# Altium schematic sheet 09 High Speed-Connector.SchDoc: CM4 IO
size 420 x 297 mm; Page Create Date: March  8, 1995; Page Number: 9; Page Size: A3; Comment: radxa_1010; Page Count: 19; RevCode: V1.10; Doc: 09 High Speed-Connector; DsnPath: D:\WMS\黄工\[RC126]CM4_IO_V1.10\[RC126]_V1.10\CM4 IO_V1.10.DSN; SchematicName: CM4 IO V1.10; PageName: 09 High Speed-Connector; PageSize: A3; TopSchematic: True
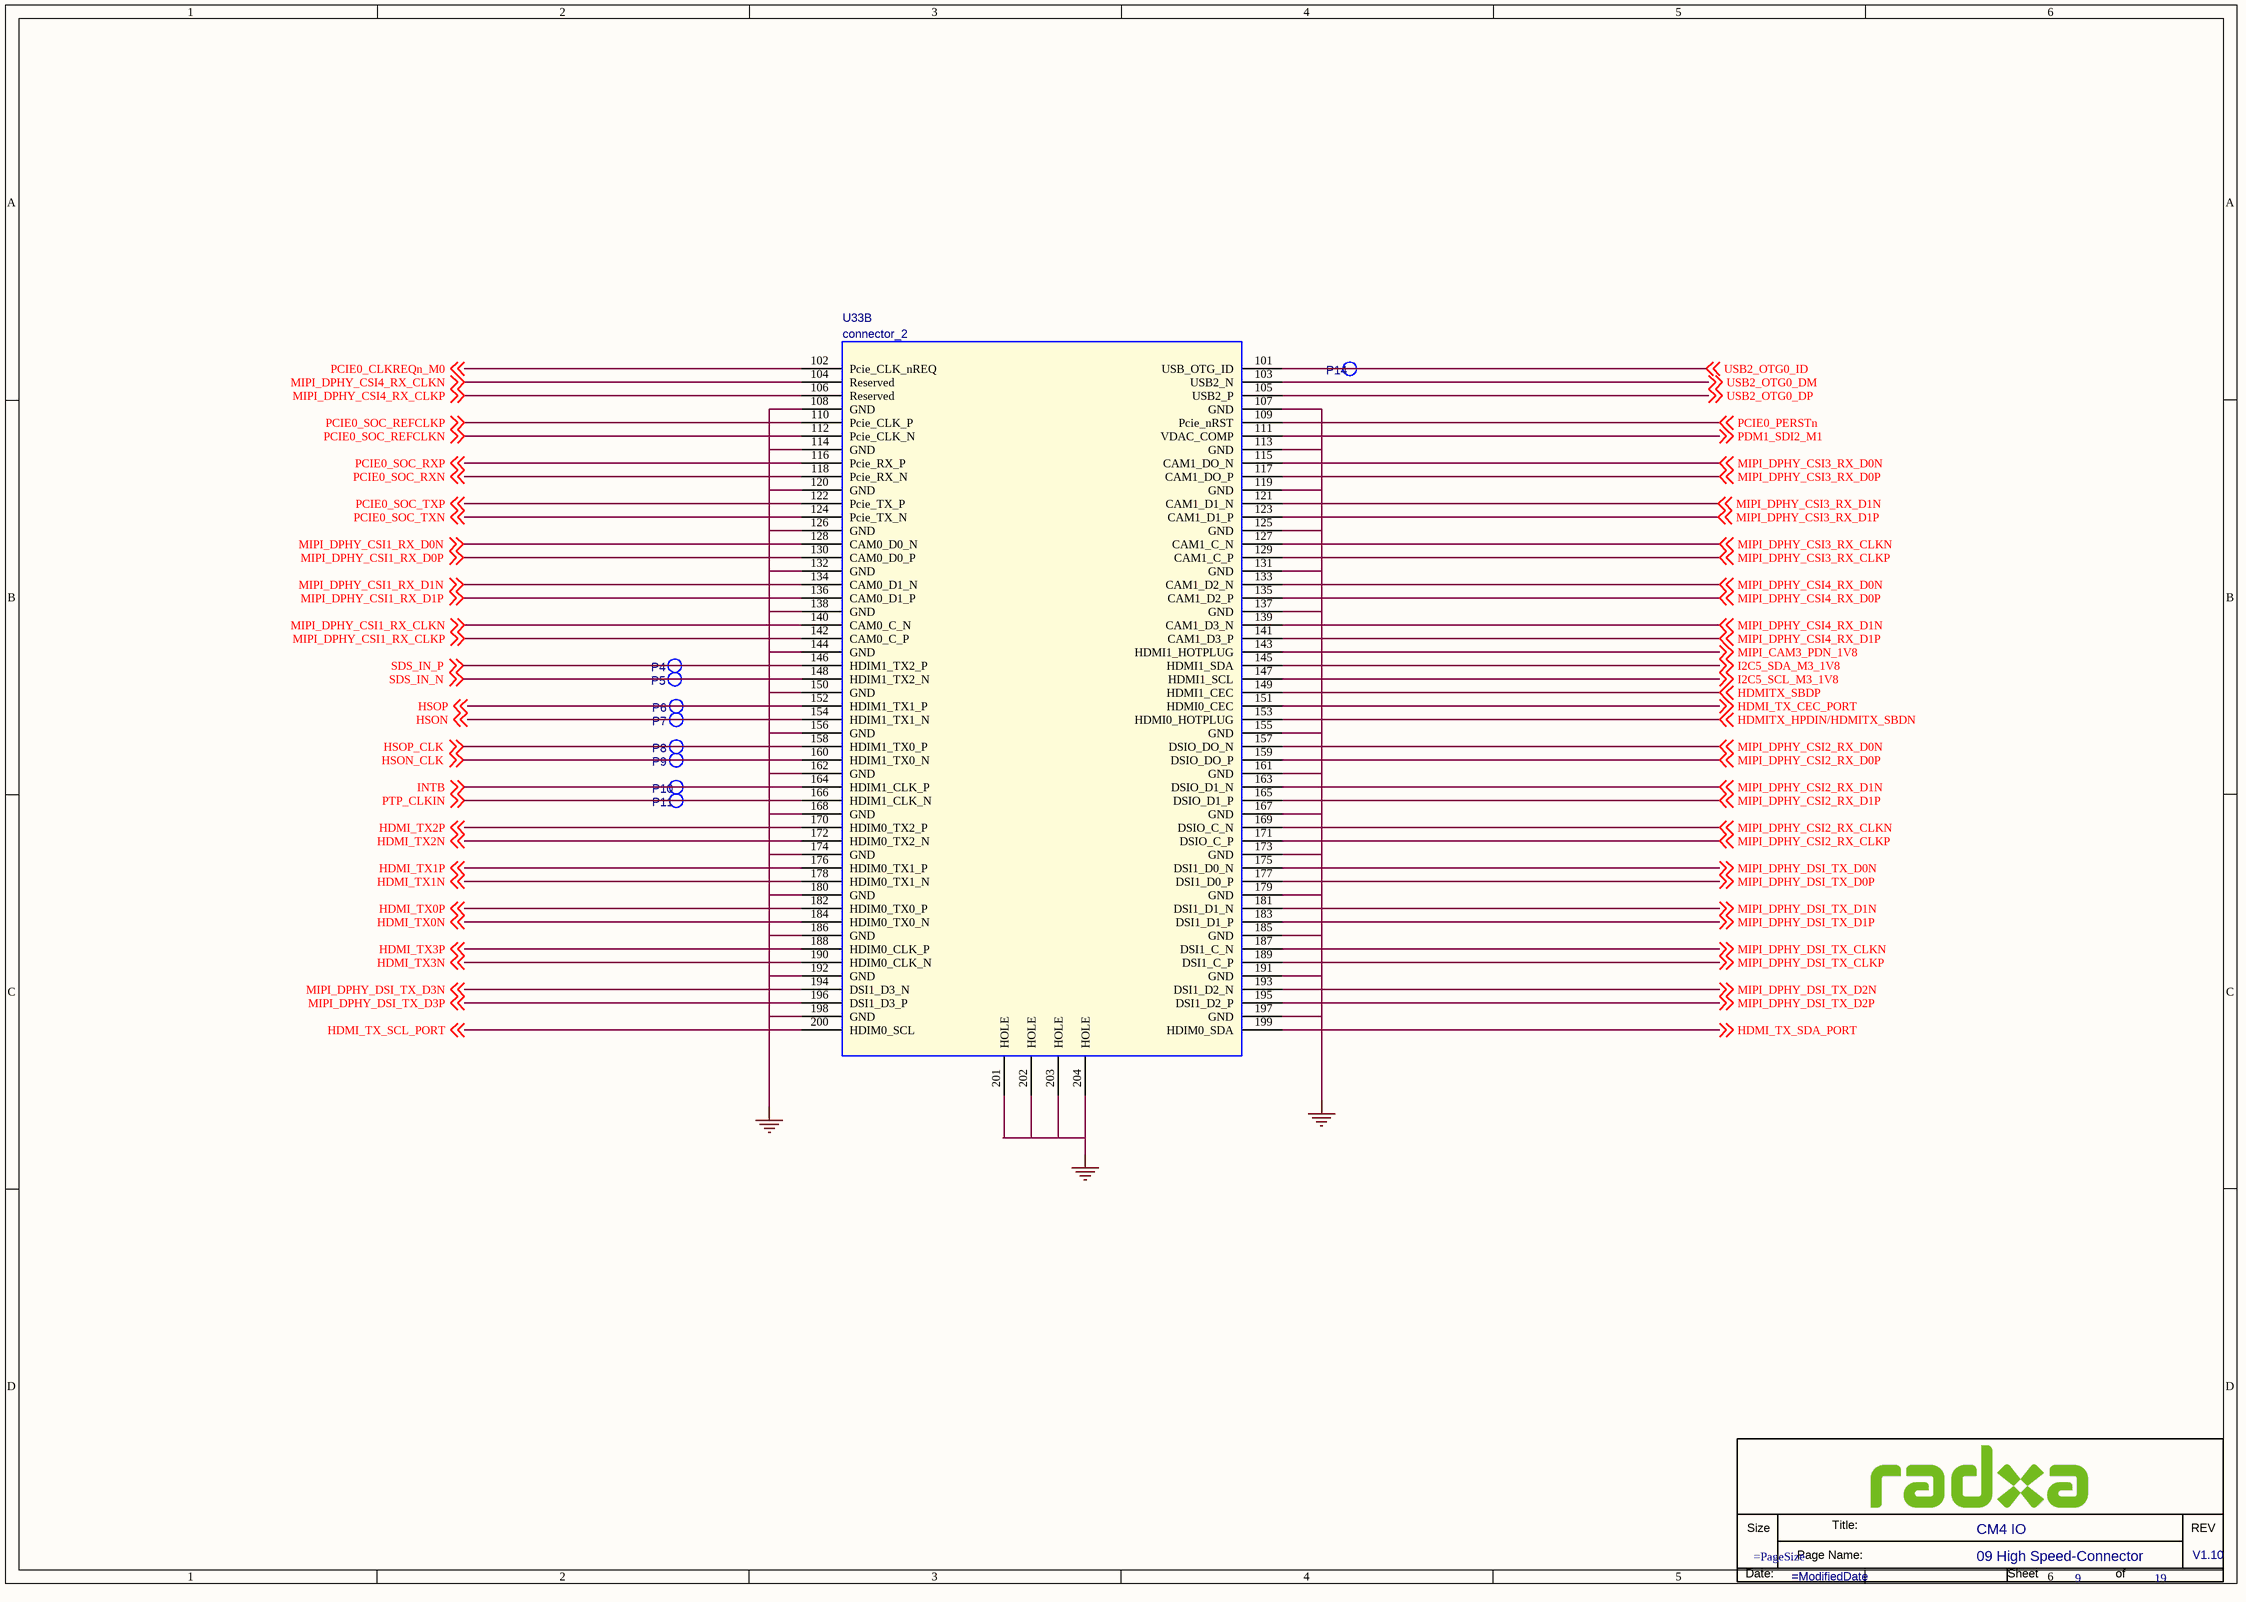
[diagram p0: 09 High Speed-Connector.SchDoc]

## Parts
*  Doc: 09 High Speed-Connector  RevCode: V1.10  Title: CM4 IO  Page Number: 9  Page Count: 19  (hidden comment: radxa_1010)  (graphical)
P4  TEST  [TEST]  (value not drawn)
P5  TEST  [TEST]  (value not drawn)
P6  TEST  [TEST]  (value not drawn)
P7  TEST  [TEST]  (value not drawn)
P8  TEST  [TEST]  (value not drawn)
P9  TEST  [TEST]  (value not drawn)
P10  TEST  [TEST]  (value not drawn)
P11  TEST  [TEST]  (value not drawn)
P14  TEST  [TEST]  (value not drawn)
U33  connector_2  [BTB_SMD100X2_0D4_STA]  (part B of 2)

## Nets
GND: U33.107(GND) U33.108(GND) U33.113(GND) U33.114(GND) U33.119(GND) U33.120(GND) U33.125(GND) U33.126(GND) U33.131(GND) U33.132(GND) U33.137(GND) U33.138(GND) U33.144(GND) U33.150(GND) U33.155(GND) U33.156(GND) U33.161(GND) U33.162(GND) U33.167(GND) U33.168(GND) U33.173(GND) U33.174(GND) U33.179(GND) U33.180(GND) U33.185(GND) U33.186(GND) U33.191(GND) U33.192(GND) U33.197(GND) U33.198(GND) U33.201(HOLE) U33.202(HOLE) U33.203(HOLE) U33.204(HOLE)
HDMI_TX0N: U33.184(HDIM0_TX0_N) ; off-sheet HDMI_TX0N
HDMI_TX0P: U33.182(HDIM0_TX0_P) ; off-sheet HDMI_TX0P
HDMI_TX1N: U33.178(HDIM0_TX1_N) ; off-sheet HDMI_TX1N
HDMI_TX1P: U33.176(HDIM0_TX1_P) ; off-sheet HDMI_TX1P
HDMI_TX2N: U33.172(HDIM0_TX2_N) ; off-sheet HDMI_TX2N
HDMI_TX2P: U33.170(HDIM0_TX2_P) ; off-sheet HDMI_TX2P
HDMI_TX3N: U33.190(HDIM0_CLK_N) ; off-sheet HDMI_TX3N
HDMI_TX3P: U33.188(HDIM0_CLK_P) ; off-sheet HDMI_TX3P
HDMI_TX_CEC_PORT: U33.151(HDMI0_CEC) ; off-sheet HDMI_TX_CEC_PORT
HDMI_TX_SCL_PORT: U33.200(HDIM0_SCL) ; off-sheet HDMI_TX_SCL_PORT
HDMI_TX_SDA_PORT: U33.199(HDIM0_SDA) ; off-sheet HDMI_TX_SDA_PORT
HDMITX_HPDIN/HDMITX_SBDN: U33.153(HDMI0_HOTPLUG) ; off-sheet HDMITX_HPDIN/HDMITX_SBDN
HDMITX_SBDP: U33.149(HDMI1_CEC) ; off-sheet HDMITX_SBDP
HSON: P7.1 U33.154(HDIM1_TX1_N) ; off-sheet HSON
HSON_CLK: P9.1 U33.160(HDIM1_TX0_N) ; off-sheet HSON_CLK
HSOP: P6.1 U33.152(HDIM1_TX1_P) ; off-sheet HSOP
HSOP_CLK: P8.1 U33.158(HDIM1_TX0_P) ; off-sheet HSOP_CLK
I2C5_SCL_M3_1V8: U33.147(HDMI1_SCL) ; off-sheet I2C5_SCL_M3_1V8
I2C5_SDA_M3_1V8: U33.145(HDMI1_SDA) ; off-sheet I2C5_SDA_M3_1V8
INTB: P10.1 U33.164(HDIM1_CLK_P) ; off-sheet INTB
MIPI_CAM3_PDN_1V8: U33.143(HDMI1_HOTPLUG) ; off-sheet MIPI_CAM3_PDN_1V8
MIPI_DPHY_CSI1_RX_CLKN: U33.140(CAM0_C_N) ; off-sheet MIPI_DPHY_CSI1_RX_CLKN
MIPI_DPHY_CSI1_RX_CLKP: U33.142(CAM0_C_P) ; off-sheet MIPI_DPHY_CSI1_RX_CLKP
MIPI_DPHY_CSI1_RX_D0N: U33.128(CAM0_D0_N) ; off-sheet MIPI_DPHY_CSI1_RX_D0N
MIPI_DPHY_CSI1_RX_D0P: U33.130(CAM0_D0_P) ; off-sheet MIPI_DPHY_CSI1_RX_D0P
MIPI_DPHY_CSI1_RX_D1N: U33.134(CAM0_D1_N) ; off-sheet MIPI_DPHY_CSI1_RX_D1N
MIPI_DPHY_CSI1_RX_D1P: U33.136(CAM0_D1_P) ; off-sheet MIPI_DPHY_CSI1_RX_D1P
MIPI_DPHY_CSI2_RX_CLKN: U33.169(DSIO_C_N) ; off-sheet MIPI_DPHY_CSI2_RX_CLKN
MIPI_DPHY_CSI2_RX_CLKP: U33.171(DSIO_C_P) ; off-sheet MIPI_DPHY_CSI2_RX_CLKP
MIPI_DPHY_CSI2_RX_D0N: U33.157(DSIO_DO_N) ; off-sheet MIPI_DPHY_CSI2_RX_D0N
MIPI_DPHY_CSI2_RX_D0P: U33.159(DSIO_DO_P) ; off-sheet MIPI_DPHY_CSI2_RX_D0P
MIPI_DPHY_CSI2_RX_D1N: U33.163(DSIO_D1_N) ; off-sheet MIPI_DPHY_CSI2_RX_D1N
MIPI_DPHY_CSI2_RX_D1P: U33.165(DSIO_D1_P) ; off-sheet MIPI_DPHY_CSI2_RX_D1P
MIPI_DPHY_CSI3_RX_CLKN: U33.127(CAM1_C_N) ; off-sheet MIPI_DPHY_CSI3_RX_CLKN
MIPI_DPHY_CSI3_RX_CLKP: U33.129(CAM1_C_P) ; off-sheet MIPI_DPHY_CSI3_RX_CLKP
MIPI_DPHY_CSI3_RX_D0N: U33.115(CAM1_DO_N) ; off-sheet MIPI_DPHY_CSI3_RX_D0N
MIPI_DPHY_CSI3_RX_D0P: U33.117(CAM1_DO_P) ; off-sheet MIPI_DPHY_CSI3_RX_D0P
MIPI_DPHY_CSI3_RX_D1N: U33.121(CAM1_D1_N) ; off-sheet MIPI_DPHY_CSI3_RX_D1N
MIPI_DPHY_CSI3_RX_D1P: U33.123(CAM1_D1_P) ; off-sheet MIPI_DPHY_CSI3_RX_D1P
MIPI_DPHY_CSI4_RX_CLKN: U33.104(Reserved) ; off-sheet MIPI_DPHY_CSI4_RX_CLKN
MIPI_DPHY_CSI4_RX_CLKP: U33.106(Reserved) ; off-sheet MIPI_DPHY_CSI4_RX_CLKP
MIPI_DPHY_CSI4_RX_D0N: U33.133(CAM1_D2_N) ; off-sheet MIPI_DPHY_CSI4_RX_D0N
MIPI_DPHY_CSI4_RX_D0P: U33.135(CAM1_D2_P) ; off-sheet MIPI_DPHY_CSI4_RX_D0P
MIPI_DPHY_CSI4_RX_D1N: U33.139(CAM1_D3_N) ; off-sheet MIPI_DPHY_CSI4_RX_D1N
MIPI_DPHY_CSI4_RX_D1P: U33.141(CAM1_D3_P) ; off-sheet MIPI_DPHY_CSI4_RX_D1P
MIPI_DPHY_DSI_TX_CLKN: U33.187(DSI1_C_N) ; off-sheet MIPI_DPHY_DSI_TX_CLKN
MIPI_DPHY_DSI_TX_CLKP: U33.189(DSI1_C_P) ; off-sheet MIPI_DPHY_DSI_TX_CLKP
MIPI_DPHY_DSI_TX_D0N: U33.175(DSI1_D0_N) ; off-sheet MIPI_DPHY_DSI_TX_D0N
MIPI_DPHY_DSI_TX_D0P: U33.177(DSI1_D0_P) ; off-sheet MIPI_DPHY_DSI_TX_D0P
MIPI_DPHY_DSI_TX_D1N: U33.181(DSI1_D1_N) ; off-sheet MIPI_DPHY_DSI_TX_D1N
MIPI_DPHY_DSI_TX_D1P: U33.183(DSI1_D1_P) ; off-sheet MIPI_DPHY_DSI_TX_D1P
MIPI_DPHY_DSI_TX_D2N: U33.193(DSI1_D2_N) ; off-sheet MIPI_DPHY_DSI_TX_D2N
MIPI_DPHY_DSI_TX_D2P: U33.195(DSI1_D2_P) ; off-sheet MIPI_DPHY_DSI_TX_D2P
MIPI_DPHY_DSI_TX_D3N: U33.194(DSI1_D3_N) ; off-sheet MIPI_DPHY_DSI_TX_D3N
MIPI_DPHY_DSI_TX_D3P: U33.196(DSI1_D3_P) ; off-sheet MIPI_DPHY_DSI_TX_D3P
PCIE0_CLKREQn_M0: U33.102(Pcie_CLK_nREQ) ; off-sheet PCIE0_CLKREQn_M0
PCIE0_PERSTn: U33.109(Pcie_nRST) ; off-sheet PCIE0_PERSTn
PCIE0_SOC_REFCLKN: U33.112(Pcie_CLK_N) ; off-sheet PCIE0_SOC_REFCLKN
PCIE0_SOC_REFCLKP: U33.110(Pcie_CLK_P) ; off-sheet PCIE0_SOC_REFCLKP
PCIE0_SOC_RXN: U33.118(Pcie_RX_N) ; off-sheet PCIE0_SOC_RXN
PCIE0_SOC_RXP: U33.116(Pcie_RX_P) ; off-sheet PCIE0_SOC_RXP
PCIE0_SOC_TXN: U33.124(Pcie_TX_N) ; off-sheet PCIE0_SOC_TXN
PCIE0_SOC_TXP: U33.122(Pcie_TX_P) ; off-sheet PCIE0_SOC_TXP
PDM1_SDI2_M1: U33.111(VDAC_COMP) ; off-sheet PDM1_SDI2_M1
PTP_CLKIN: P11.1 U33.166(HDIM1_CLK_N) ; off-sheet PTP_CLKIN
SDS_IN_N: P5.1 U33.148(HDIM1_TX2_N) ; off-sheet SDS_IN_N
SDS_IN_P: P4.1 U33.146(HDIM1_TX2_P) ; off-sheet SDS_IN_P
USB2_OTG0_DM: U33.103(USB2_N) ; off-sheet USB2_OTG0_DM
USB2_OTG0_DP: U33.105(USB2_P) ; off-sheet USB2_OTG0_DP
USB2_OTG0_ID: P14.1 U33.101(USB_OTG_ID) ; off-sheet USB2_OTG0_ID

## Notes on the sheet
- (in symbol radxa_1010) Size; Title:; REV; Page Name:; Date:; Sheet; of

## Library data of the parts
P4 = TESTPOINT1: Part Reference: P4; PCB Footprint: TP_0R70; Value: TEST
P5 = TESTPOINT1: Part Reference: P5; PCB Footprint: TP_0R70; Value: TEST
P6 = TESTPOINT1: Part Reference: P6; PCB Footprint: TP_0R70; Value: TEST
P7 = TESTPOINT1: Part Reference: P7; PCB Footprint: TP_0R70; Value: TEST
P8 = TESTPOINT1: Part Reference: P8; PCB Footprint: TP_0R70; Value: TEST
P9 = TESTPOINT1: Part Reference: P9; PCB Footprint: TP_0R70; Value: TEST
P10 = TESTPOINT1: Part Reference: P10; PCB Footprint: TP_0R70; Value: TEST
P11 = TESTPOINT1: Part Reference: P11; PCB Footprint: TP_0R70; Value: TEST
P14 = TESTPOINT1: Part Reference: P14; PCB Footprint: TP_0R70; Value: TEST
U33 = HETER_4: Part Reference: U33; Value: connector_2; PCB Footprint: BTB_SMD100X2_0D4_STA
* = radxa_1010: Page Create Date: March  8, 1995; Page Size: =PageSize; Page Modify Date: =ModifiedDate